# EAGLE design DigisparkBT_Shield (EAGLE 7.1.0)
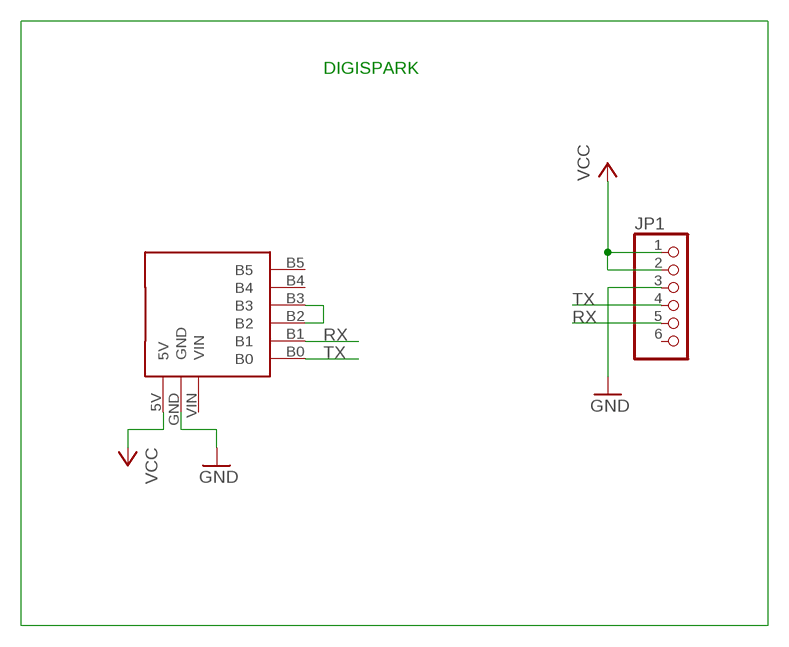
[diagram p0: schematic, sheet 1]

## Parts
JP1  PINHD-1X6  [1X06]
U$1  DIGISPARK_SHIELD  [DIGISPARK-SHIELD]

## Nets
GND: JP1.3 U$1.GND
N$1: U$1.B2 U$1.B3
RX: JP1.5 U$1.B1
TX: JP1.4 U$1.B0
VCC: JP1.1 JP1.2 U$1.5V
Unconnected: JP1.6 U$1.B4 U$1.B5 U$1.VIN

## Notes on the sheet
- DIGISPARK

## Library data of the parts
JP1 = pinhead:PINHD-1X6: PIN HEADER
U$1 = mi_lib:DIGISPARK_SHIELD: Digispark Shield

## Board
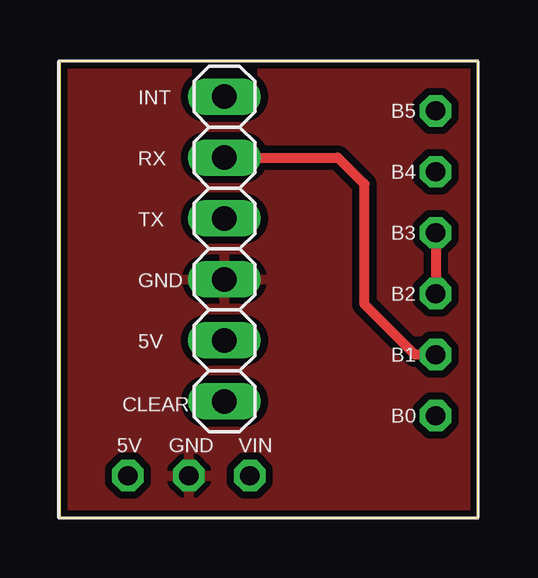
[diagram p1: board, top side]
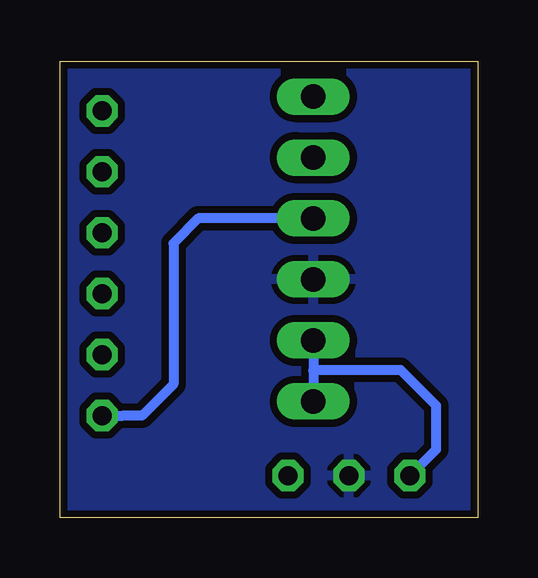
[diagram p2: board, bottom side, seen from below]

Size 17.43 x 19.03 mm. Coordinates in mm from the lower left corner, seen from the top.
Outline: 0,0 17.43,0 17.43,19.03 0,19.03 0,0
Copper layers (1*16): Top 0.035mm / dielectric 1.5mm / Bottom 0.035mm
Design rules "dirt_cheap_dirty_boards.v1": minimum track width 5mil, minimum drill 12mil, track to track 5mil, track to pad 5mil, pad to pad 5mil, via to via 5mil, smd to smd 0mil, copper to edge 10mil, drill to drill 10mil, minimum pad ring 10mil, minimum via ring 6mil, stop-mask expansion 2mil, vias tented up to drill 25mil, thermal gap 10mil

### Footprints (pad centres in the part's own frame; a part is rotated, then mirrored left to right if it is on the bottom)
1X06 = drill 1.016 long: 1 -6.35,0; 2 -3.81,0; 3 -1.27,0; 4 1.27,0; 5 3.81,0; 6 6.35,0
DIGISPARK-SHIELD = drill 0.8 octagon: 5V 2.9,1.75; B0 15.73,4.25; B1 15.73,6.79; B2 15.73,9.33; B3 15.73,11.87; B4 15.73,14.41; B5 15.73,16.95; GND 5.44,1.75; VIN 7.98,1.75

### Placement (x,y rotation side)
JP1  6.86,11.2 90 top
U$1  -0.06,0.01 0 top

### Tracks (layer width: path | path; a pad name or v marks a point on that pad's centre or on a via)
GND
  pour Bottom (isolate 0.305): 0,0 17.44,-0.1 17.44,18.95 0,19.05
  pour Top (isolate 0.305): 0,0 17.49,-0.1 17.49,18.95 0,19.05
N$1
  Top 0.406: U$1.B3 U$1.B2
RX
  Top 0.406: U$1.B1 14.79,6.8 12.7,8.89 12.7,13.9 11.59,15.01 JP1.5
TX
  Bottom 0.406: U$1.B0 14.79,4.26 14.01,4.26 12.7,5.56 12.7,11.43 11.66,12.47 JP1.4
VCC
  Bottom 0.406: JP1.2 6.86,6.13 | 6.86,6.13 JP1.1 | U$1.5V 1.74,2.85 1.74,4.67 3.23,6.17 6.83,6.17 6.86,6.13

### Text on the board
tSilk: INT | RX | TX | GND | 5V | CLEAR